# Altium schematic sheet Current_Source.SchDoc
size A; SheetNumber: 16; SheetTotal: 16
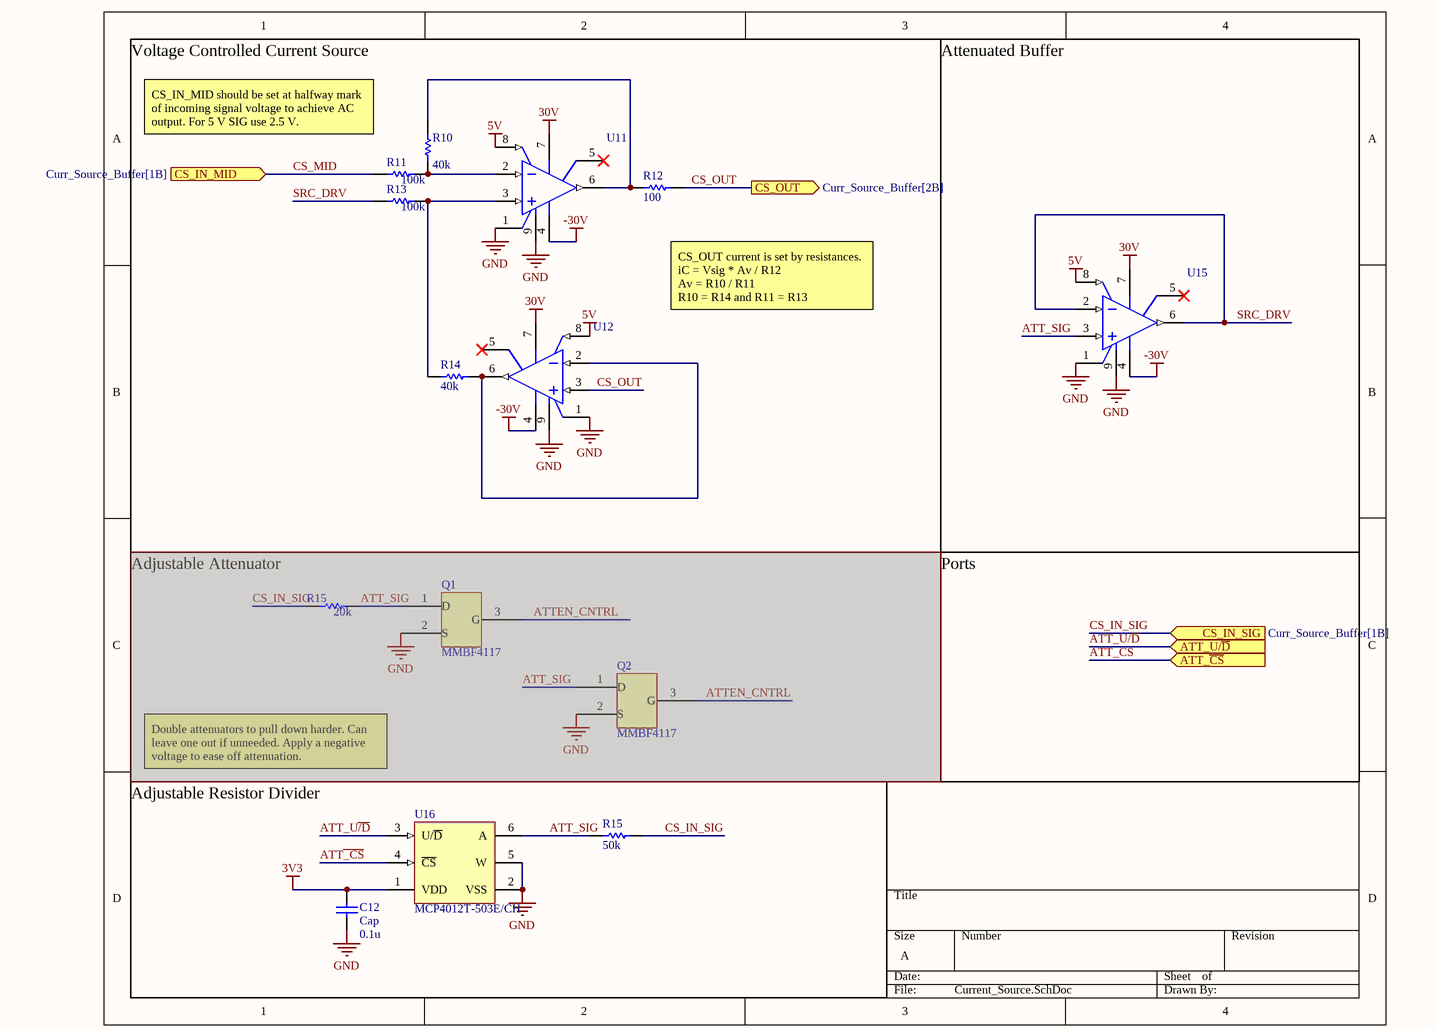
[diagram p0: Current_Source.SchDoc]

## Parts
(Parts that share a designator on the sheet are numbered #1, #2 ... from top to bottom, then left to right.)
C12  Cap  value 0.1u  [CAPC1608X05N]
Q1  Attenuator JFET  [MMBF4117]  (value not drawn)  (masked out: inside a compile mask, not in the netlist)
Q2  Attenuator JFET  [MMBF4117]  (value not drawn)  (masked out: inside a compile mask, not in the netlist)
R10  value 40k  [0402_Res]  (hidden comment: DNP)
R11  value 100k  [0402_Res]  (hidden comment: DNP)
R12  value 100  [0402_Res]  (hidden comment: DNP)
R13  value 100k  [0402_Res]  (hidden comment: DNP)
R14  value 40k  [0402_Res]  (hidden comment: DNP)
R15#1  value 20k  [0402_Res]  (hidden comment: DNP)  (masked out: inside a compile mask, not in the netlist)
R15#2  value 50k  [0402_Res]  (hidden comment: DNP)
U11  OPA454AIDDA  [DDA0008C_L]  (value not drawn)
U12  OPA454AIDDA  [DDA0008C_L]  (value not drawn)
U15  OPA454AIDDA  [DDA0008C_L]  (value not drawn)
U16  MCP4012T-503E/CH  [SOT-23-CH6_M]

## Blocks framed on the sheet
Adjustable Resistor Divider: C12 R15#2 U16

## Ports
ATT_U/~{D} (in), ATT_~{CS} (in), CS_IN_MID (in, see Curr_Source_Buffer[1B]), CS_IN_SIG (in, see Curr_Source_Buffer[1B]), CS_OUT (out, see Curr_Source_Buffer[2B])

## Nets
3V3: C12.2 U16.1(VDD)
5V: U11.8(E/D) U12.8(E/D) U15.8(E/D)
30V: U11.7(V+) U12.7(V+) U15.7(V+)
-30V: U11.4(V-) U12.4(V-) U15.4(V-)
GND: C12.1 U11.1(E/D_COM) U11.9(EP) U12.1(E/D_COM) U12.9(EP) U15.1(E/D_COM) U15.9(EP) U16.2(VSS) U16.5(W)
ATT~{_CS}: U16.4(~{CS})
ATT_~{CS}: port ATT_~{CS}
ATT_SIG: R15#2.2 U15.3(IN+) U16.6(A)
ATT_U~{/D}: U16.3(U/~{D})
ATT_U/~{D}: port ATT_U/~{D}
CS_IN_SIG: R15#2.1 ; port CS_IN_SIG
CS_MID: R11.2 ; port CS_IN_MID
CS_OUT: R12.1 U12.3(IN+) ; port CS_OUT
SRC_DRV: R13.2 U15.2(IN-) U15.6(OUT)
NetR10_1: R10.1 R11.1 U11.2(IN-)
NetR10_2: R10.2 R12.2 U11.6(OUT)
NetR13_1: R13.1 R14.2 U11.3(IN+)
NetR14_1: R14.1 U12.2(IN-) U12.6(OUT)

Not connected (* = marked no-connect by the designer): U11 5(STATUS_FLAG)*; U12 5(STATUS_FLAG)*; U15 5(STATUS_FLAG)*

## Notes on the sheet
- Voltage Controlled Current Source
- Attenuated Buffer
- CS_IN_MID should be set at halfway mark of incoming signal voltage to achieve AC output. For 5 V SIG use 2.5 V.
- CS_OUT current is set by resistances.
  iC = Vsig * Av / R12
  Av = R10 / R11
  R10 = R14 and R11 = R13
- (near R15#1) Adjustable Attenuator
- Ports
- Double attenuators to pull down harder. Can leave one out if unneeded. Apply a negative voltage to ease off attenuation.
- (in symbol MMBF4117) D; G; S

## Library data of the parts
C12 = Cap: Capacitor; Published: 8-Jun-2000; LatestRevisionDate: 17-Jul-2002; LatestRevisionNote: Re-released for DXP Platform.; PackageReference: RAD-0.3; Publisher: Altium Limited; PackageDescription: Radial Cap, Thru-Hole; 2 Leads; 0.3 in Pin Spacing
Q1 Q2 = MMBF4117: Supplier 1: Arrow Electronics; Supplier Part Number 1: MMBF4117
R10-R14 R15#1 R15#2 = Res1: Resistor; Published: 8-Jun-2000; LatestRevisionDate: 17-Jul-2002; LatestRevisionNote: Re-released for DXP Platform.; PackageReference: AXIAL-0.3; Publisher: Altium Limited; PackageDescription: Axial Device, Thru-Hole; 2 Leads; 0.3 in Pin Spacing
U11 U12 U15 = CMP-0017-00714-2: High Voltage (100V), High-Current (50mA) Operational Amplifier, G=1 Stable, 10 to 100 V, -55 to 125 degC, 8-pin SOP (DDA8), Green (RoHS & no Sb/Br); Manufacturer: Texas Instruments; Number of Channels: 1; CMRR(Min)(dB): 100; Rating: Catalog; Total Supply Voltage(Min)(+5V is 5, +/-5V is 10): 10; Offset Drift(Typ)(uV/C): 1.6; Vn at 1kHz(Typ)(nV/rtHz): 47; Slew Rate(Typ)(V/us): 13; Sub Family: General Purpose Amplifier, High Output Current Amplifier (>=50mA), High Supply Voltage Amplifier (>=30V), Precision Amplifier; Iq per channel(Max)(mA): 4; GBW(Typ)(MHz): 2.5; Code_JEDEC: MS-012; ComponentLink3URL: http://www.ti.com/litv/pdf/mpds092e; ComponentLink1Description: Manufacturer URL; PackageDescription: 8-Pin PowerPAD(TM) Plastic Small Outline, Body 3.9 x 4.9 mm, Pitch 1.27 mm; PackageVersion: 4202561/F, 12/2011; ComponentLink3Description: Package Specification; ComponentLink2URL: http://www.ti.com/lit/ds/symlink/opa454.pdf; ComponentLink2Description: Datasheet; IIB(Max)(pA): 100; ComponentLink1URL: http://www.ti.com/; DatasheetVersion: SBOS391A; Total Supply Voltage(Max)(+5V is 5, +/-5V is 10): 100; Eco-Plan: Green (RoHS & no Sb/Br); Mounting Technology: Surface Mount; Vio (25C)(Max)(mV): 4; PackageReference: DDA0008C; PartNumber: OPA454AIDDA
U16 = CMP-0188-00744-2: Low-Cost 64-Step Volatile Digital POT, 6-Pin SOT-23, Extended Temperature, Tape and Reel; ComponentLink3Description: Package Specification; ComponentLink1Description: Manufacturer URL; PackageDescription: 6-Lead Plastic Small Outline Transistor (CH) [SOT-23]; ComponentLink2Description: Datasheet; ComponentLink3URL: http://www.microchip.com/stellent/groups/techpub_sg/documents/packagingspec/en012702.pdf; DatasheetVersion: revC, Dec-2006; PackageVersion: revBB, Aug-2009; Code_IPC: SOT26A-6; PackageReference: SOT-23-CH6; RevisionNote: URLs added.; ComponentLink2URL: http://ww1.microchip.com/downloads/en/DeviceDoc/21978c.pdf; ComponentLink1URL: http://www.microchip.com/